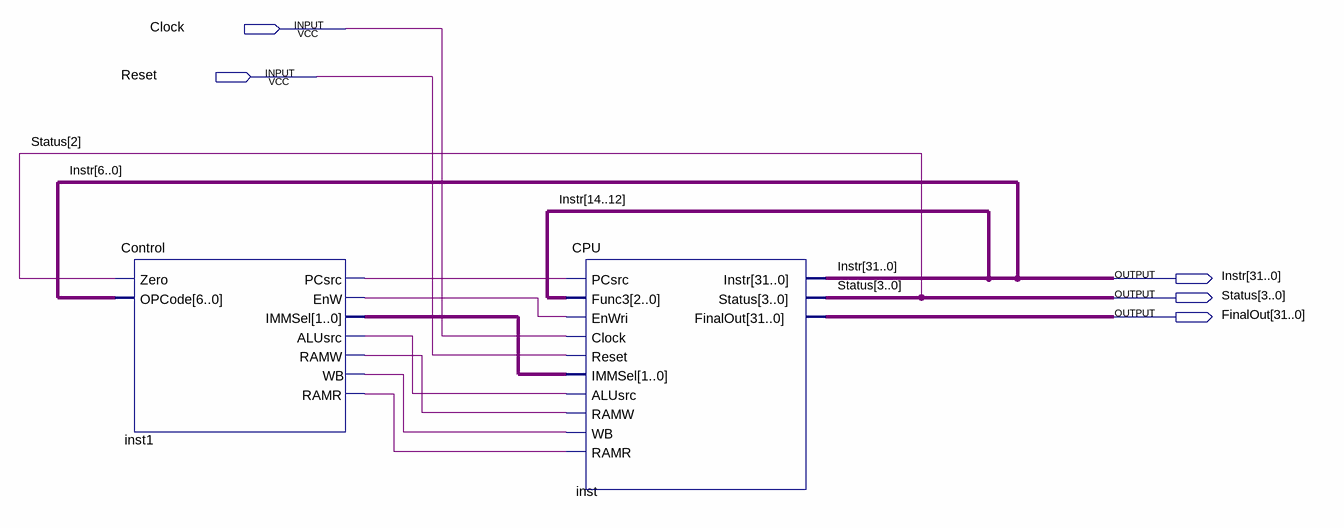
[diagram p0: schematic sheet]
// Quartus schematic CPU_Complete.bdf as structural Verilog: 2 symbols, 5 pins
module CPU_Complete (
  input  Clock,
  input  Reset,
  output [31:0] Instr,
  output [3:0] Status,
  output [31:0] FinalOut
);

  wire inst1_alusrc, inst1_enw, inst1_pcsrc, inst1_ramr, inst1_ramw, inst1_wb;
  wire [1:0] inst1_immsel;

  Control inst1 (
    .Zero(Status[2]), .OPCode(Instr[6:0]), .PCsrc(inst1_pcsrc), .EnW(inst1_enw), .IMMSel(inst1_immsel),
    .ALUsrc(inst1_alusrc), .RAMW(inst1_ramw), .WB(inst1_wb), .RAMR(inst1_ramr));
  CPU inst (
    .PCsrc(inst1_pcsrc), .Func3(Instr[14:12]), .EnWri(inst1_enw), .Clock(Clock), .Reset(Reset),
    .IMMSel(inst1_immsel), .ALUsrc(inst1_alusrc), .RAMW(inst1_ramw), .WB(inst1_wb), .RAMR(inst1_ramr),
    .Instr(Instr), .Status(Status), .FinalOut(FinalOut));
endmodule
